# Altium schematic sheet 5V.SchDoc
size A4
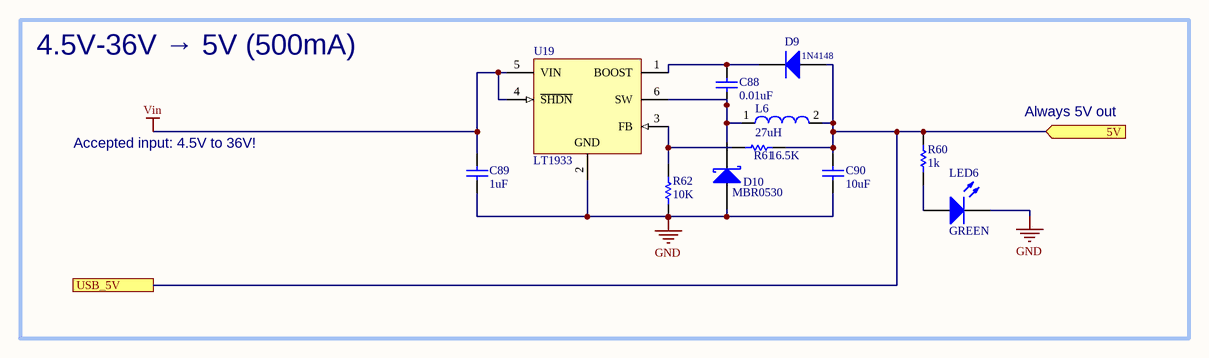
[diagram p0: 5V.SchDoc]

## Parts
C88  0.01uF  [CAPC1608X87X35NL15T15]
C89  1uF  [CAPC1608X87X35NL15T15]
C90  10uF  [CAPC1608X90X35NL10T15]
D9  1N4148  [DIOD-SOD123-2_V]
D10  MBR0530  [FAIR-SOD123-2_V]
L6  27uH  [WE-PD-M-PB]
LED6  GREEN  [0603_A]
R60  1k  [RESC0603(1608)_L]
R61  16.5K  [RESC0603(1608)_L]
R62  10K  [RESC0603(1608)_L]
U19  LT1933  [LT-S6-6-SOT-23_L]

## Ports
5V (in), USB_5V

## Nets
GND: C89.1 C90.1 D10.1(A) LED6.1(K) R62.1 U19.2(GND)
Vin: C89.2 U19.4(~{SHDN}) U19.5(VIN)
5V: C90.2 D9.1(A) L6.2 R60.2 R61.1 ; port 5V, port USB_5V
NetC88_1: C88.1 D10.2(K) L6.1 U19.6(SW)
NetC88_2: C88.2 D9.2(K) U19.1(BOOST)
NetLED6_2: LED6.2(A) R60.1
NetR61_2: R61.2 R62.2 U19.3(FB)

## Notes on the sheet
- 4.5V-36V → 5V (500mA)
- Accepted input: 4.5V to 36V!
- Always 5V out

## Library data of the parts
C88 = CMP-2006-03308-1: 0.01uF 0603 50V; Manufacturer: Kemet; Part Number: C0603C101J5GACTU
C89 = CMP-2006-03308-1: 1uF 0603 50V; Manufacturer: Kemet; Part Number: C0603C101J5GACTU
C90 = CMP-2006-02792-1: Part Number: GRM188R60J106ME47D; Manufacturer: Murata
D9 = CMP-2000-04932-2: Fast Switching Diode, 100 V, 0.15 A, -65 to 150 degC, 2-Pin?SOD123, RoHS, Tape and Reel; Recovery Time: 4ns; Brand: DiodesIncorporated; Unit Weight: 0.000353oz; Max Surge Current: 2A; Peak Reverse Voltage: 100V; Ir - Reverse Current: 1uA; Vf - Forward Voltage: 1.25V; Configuration: Single; If - Forward Current: 0.15A; Product Category: Diodes-GeneralPurpose,Power,Switching; Operating Temperature Range: -65Cto+150C; Packaging: Reel; Manufacturer URL: http://www.diodes.com/; Maximum Operating Temperature: +150C; Height: 1.25mm; Minimum Operating Temperature: -65C; Product: SwitchingDiodes; Package URL: http://www.diodes.com/datasheets/ds18004.pdf; Type: SwitchingDiode; Package Reference: SOD123-2; Width: 1.7mm; Datasheet URL: http://www.farnell.com/datasheets/1915529.pdf; Datasheet Version: Rev. 24-2, 10/2013; Series: 1N4148; Factory Pack Quantity: 3000; Length: 2.85mm; RoHS: True; Manufacturer: DiodesIncorporated; Mounting Style: SMD/SMT; Package / Case: SOD-123
D10 = CMP-2000-05113-1: Diode Schottky 30V 0.5A 2-Pin SOD-123 T/R; Manufacturer: Fairchild; Speed: FastRecovery=200mA(Io); Voltage - Forward (Vf) (Max) @ If: 430mV@500mA; Online Catalog: SchottkyDiode; Current - Reverse Leakage @ Vr: 130µA@30V; Current - Average Rectified (Io): 500mA; Other Names: MBR0530CT; Reverse Recovery Time (trr): -; Category: DiscreteSemiconductorProducts; Package / Case: SOD-123; Capacitance @ Vr, F: -; Operating Temperature - Junction: -65degC~125degC; Standard Package: 1; Packaging: CutTape(CT); Family: Diodes,Rectifiers-Single; Diode Type: Schottky; Series: -; Datasheet Version: Rev. 1.1.0, 10/2014; Supplier Device Package: SOD-123; Mounting Type: SurfaceMount; Datasheet URL: https://www.fairchildsemi.com/datasheets/MB/MBR0530.pdf; Manufacturer URL: https://www.fairchildsemi.com/; Voltage - DC Reverse (Vr) (Max): 30V
L6 = CMP-1396-00053-1: SMD-Shielded Power Inductor WE-PD, L=27 µH; Manufacturer: Wuerth Elektronik; PartNumber: 7447779127; Inductance: 27 ÂµH; PackageDescription: SMD Inductor, 2-Leads, Body 7.3 x 7.3 mm; ComponentLink2Description: Datasheet; PackageReference: WE-PD-M-PB; ComponentLink1Description: Manufacturer URL; ComponentLink2URL: http://www.we-online.de/katalog/media/pdf/7447779127.pdf; ComponentLink1URL: http://www.we-online.com
LED6 = CMP-1426-00006-1: SMD mono-color Chip LED, WL-SMCW, Bright Green; PartNumber: 150060VS75000; Manufacturer: Wuerth Elektronik; ComponentLink2URL: http://katalog.we-online.com/led/datasheet/150060VS75000.pdf; ComponentLink1Description: Manufacturer URL; PackageReference: 0603_A; ComponentLink2Description: Datasheet; ComponentLink1URL: http://www.we-online.com; Color: Bright Green
R60 = CMP-1012-00062-1: 1k 0.1W 5% 0603 (1608 Metric)  SMD; Value: 1000.00 Ohm; Case-EIA: 0603; Case-Metric: 1608; Tolerance: 5 %; Power: 0.1 W; Technology: SMT
R61 = CMP-1012-00062-1: 16.5K 0.1W 5% 0603 (1608 Metric)  SMD; Value: 16500Ohm; Case-EIA: 0603; Case-Metric: 1608; Tolerance: 5 %; Power: 0.1 W; Technology: SMT
R62 = CMP-1012-00062-1: 10K 0.1W 5% 0603 (1608 Metric)  SMD; Value: 10000 Ohm; Case-EIA: 0603; Case-Metric: 1608; Tolerance: 5 %; Power: 0.1 W; Technology: SMT
U19 = CMP-0491-01634-1: 600 mA, 500 kHz Step-Down Switching Regulator, 6-pin SOT23 (S6-6), -40 to 85 degC, Pb-Free, Tape and Reel; PartNumber: LT1933ES6#TRPBF; Manufacturer: Linear Technology; Number of Outputs: 1; Packing: Tape and Reel; ComponentLink3URL: http://cds.linear.com/docs/en/datasheet/175435f.pdf; ComponentLink1Description: Manufacturer URL; ComponentLink2Description: Datasheet; ComponentLink2URL: http://cds.linear.com/docs/en/datasheet/1933fe.pdf; Mounting Technology: Surface Mount; ComponentLink1URL: http://www.linear.com/; PackageVersion: Aug-07; PackageDescription: 6-Pin Plastic SOT-23, Body 1.625 x 2.9 mm, Pitch 0.95 mm; PackageReference: S6-6; DatasheetVersion: Rev. E; RoHS: TRUE; ComponentLink3Description: Package Specification